# EAGLE design nodeconf2018 (EAGLE 7.7.0)
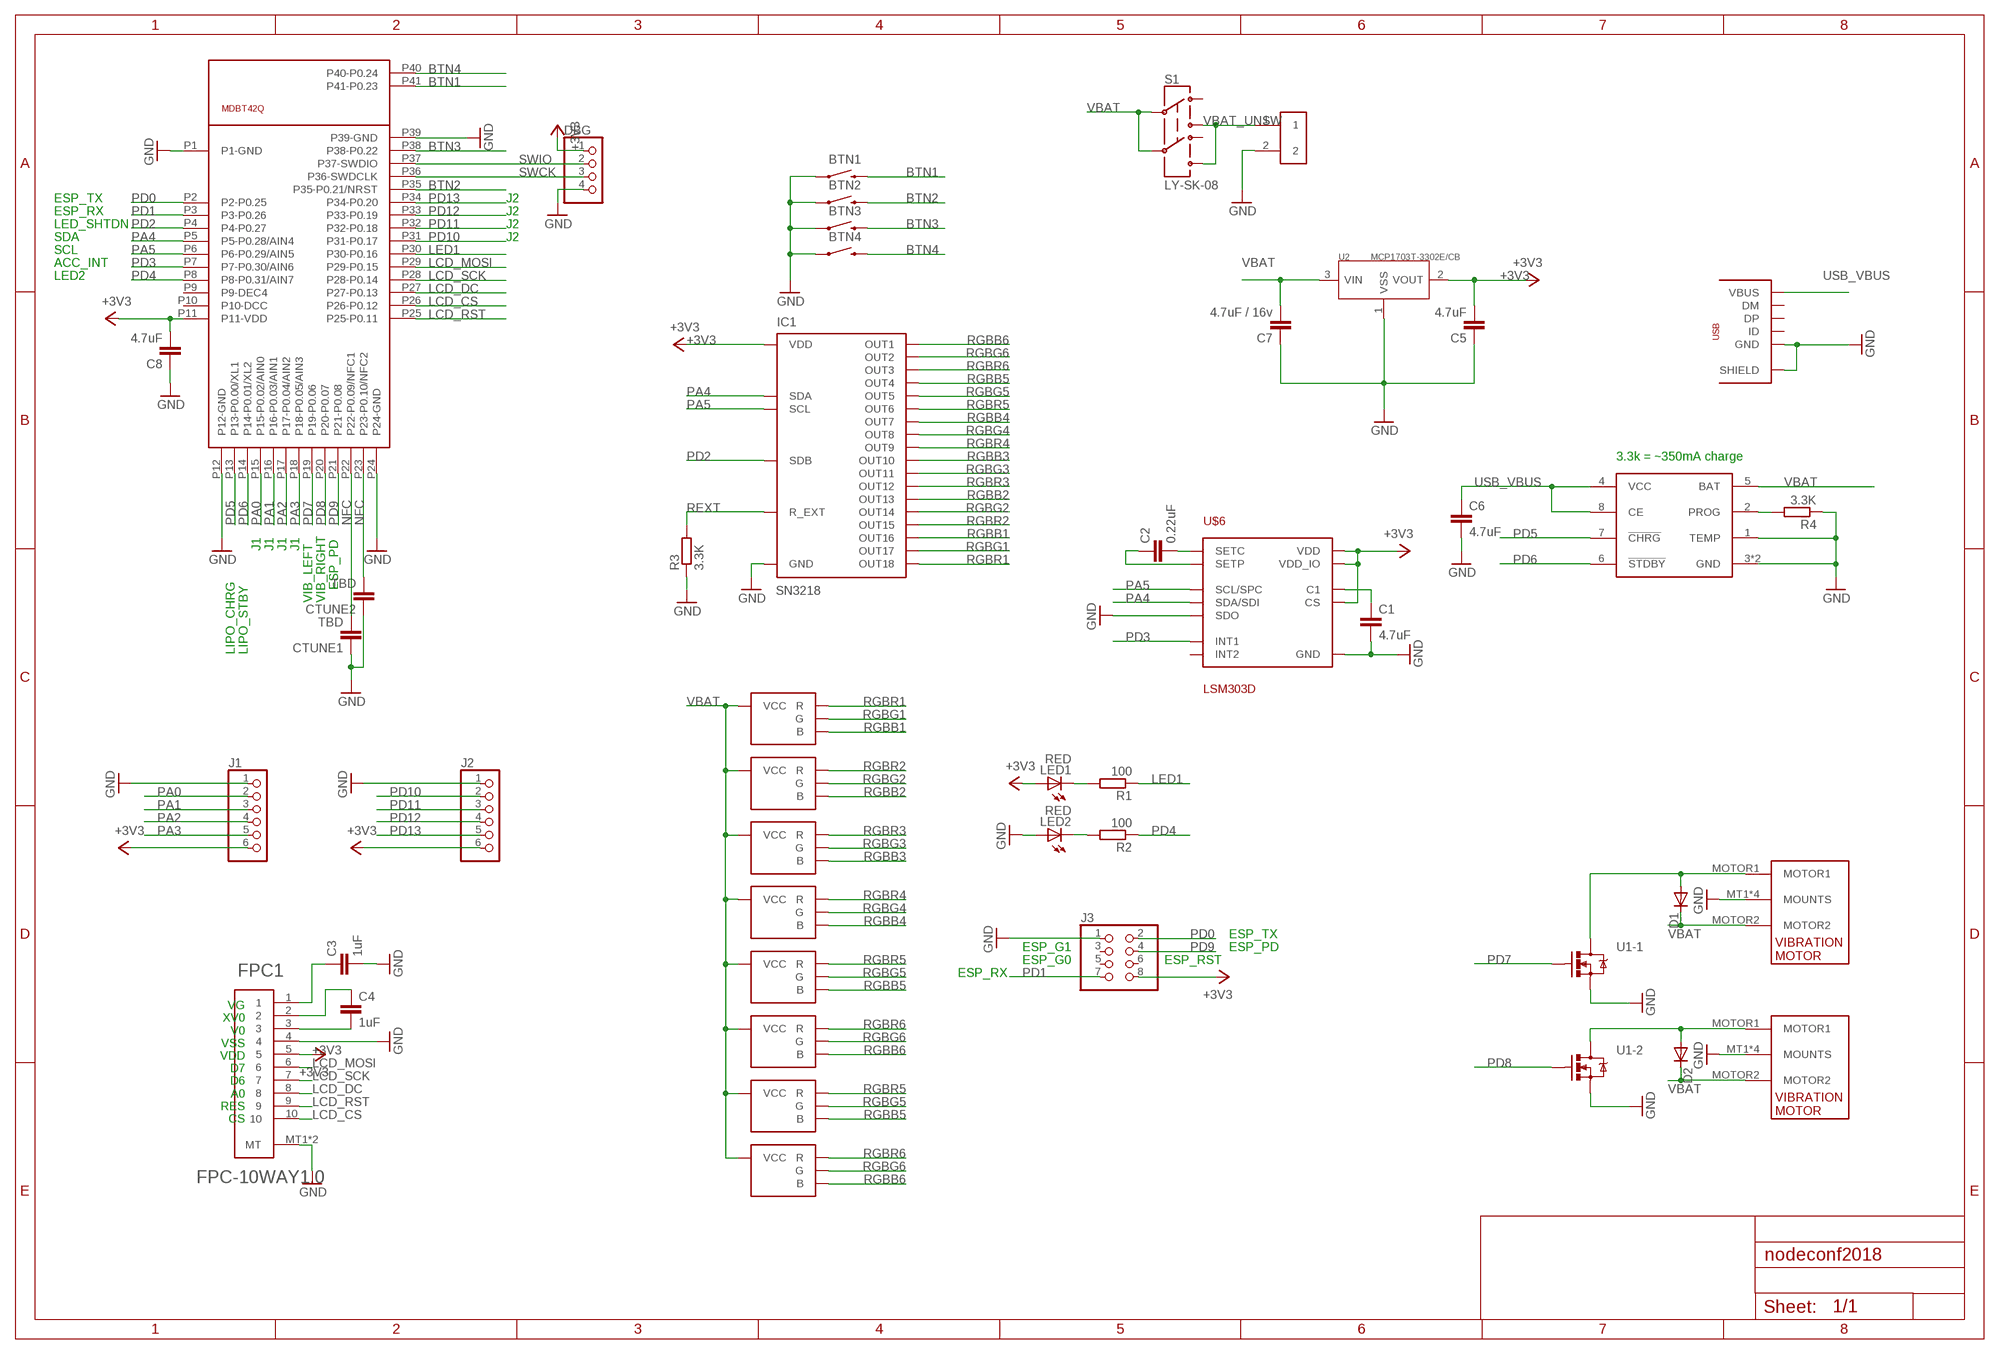
[diagram p0: schematic, sheet 1]

## Parts
BAT  JST_2P_VERTICAL  [2P_JST_PH_VERT]
BLED1  1204RGBC3ADA  [APFA3010SEEZGQBDC]
BLED2  1204RGBC3ADA  [APFA3010SEEZGQBDC]
BLED3  1204RGBC3ADA  [APFA3010SEEZGQBDC]
BLED4  1204RGBC3ADA  [APFA3010SEEZGQBDC]
BLED5  1204RGBC3ADA  [APFA3010SEEZGQBDC]
BLED6  1204RGBC3ADA  [APFA3010SEEZGQBDC]
BLED7  1204RGBC3ADA  [APFA3010SEEZGQBDC]
BLED8  1204RGBC3ADA  [APFA3010SEEZGQBDC]
BTN1  SWITCH-MOMENTARY-2SMD-1101NE  [TACTILE-SWITCH-1101NE]
BTN2  SWITCH-MOMENTARY-2SMD-1101NE  [TACTILE-SWITCH-1101NE]
BTN3  SWITCH-MOMENTARY-2SMD-1101NE  [TACTILE-SWITCH-1101NE]
BTN4  SWITCH-MOMENTARY-2SMD-1101NE  [TACTILE-SWITCH-1101NE]
C1  4.7uF  C-EUC0805  [C0805]
C2  0.22uF  C-EUC0603K  [C0603K]
C3  1uF  C-EUC0603K  [C0603K]
C4  1uF  C-EUC0603K  [C0603K]
C5  4.7uF  C-EUC0805  [C0805]
C6  4.7uF  C-EUC0805  [C0805]
C7  4.7uF / 16v  C-EUC0805  [C0805]
C8  4.7uF  C-EUC0603K  [C0603K]
CTUNE1  TBD  C-EUC0603K  [C0603K]
CTUNE2  TBD  C-EUC0603K  [C0603K]
D1  DIODE-SOD323-W  [SOD323-W]
D2  DIODE-SOD323-W  [SOD323-W]
DBG  PINHD-1X04_2.54-S  [1X04-S]
FPC1  FPC-10WAY1.0  [FPC-1.0MM-10WAY]
IC1  SN3218  [QFN24]
J1  PINHD-1X06_2.54-S  [1X06-S]
J2  PINHD-1X06_2.54-S  [1X06-S]
J3  PINHD-2X04_2.54  [2X04]
LED1  RED  LEDCHIP-LED0603  [CHIP-LED0603]
LED2  RED  LEDCHIP-LED0603  [CHIP-LED0603]
R1  100  R-EU_R0603  [R0603]
R2  100  R-EU_R0603  [R0603]
R3  3.3K  R-EU_R0603  [R0603]
R4  3.3K  R-EU_R0603  [R0603]
S1  LY-SK-08  SWITCH-DPDT  [SWITCH-DPDT]
U1  MOSFET-N-DUAL  [SOT563]
U2  MCP1703T-3302E/CB  XC6206  [SOT23]
U3  TP4056  [SO08-PAD-300]
U$1  VIBRATION_MOTOR  [VIBRATION_MOTOR]
U$2  VIBRATION_MOTOR  [VIBRATION_MOTOR]
U$3  MDBT42Q  [MDBT40]
U$4  USBMICROB  [MICROB-USB]
U$6  LSM303D  [LGA16-3MM]

## Nets
+3V3: C5.2 C8.2 DBG.1 FPC1.5 IC1.3(VDD) J1.6 J2.6 J3.8 LED1.A U2.2(VOUT) U$3.P11(P11-VDD) U$6.1(VDD_IO) U$6.8(CS) U$6.14(VDD)
BTN1: BTN1.2 U$3.P41(P41-P0.23)
BTN2: BTN2.2 U$3.P35(P35-P0.21/NRST)
BTN3: BTN3.2 U$3.P38(P38-P0.22)
BTN4: BTN4.2 U$3.P40(P40-P0.24)
GND [pwr]: BAT.2 BTN1.1 BTN2.1 BTN3.1 BTN4.1 C1.2 C3.2 C5.1 C6.2 C7.1 C8.1 CTUNE1.1 CTUNE2.1 DBG.4 FPC1.4 FPC1.MT1(MT) FPC1.MT2(MT) IC1.4(GND) IC1.GND J1.1 J2.1 J3.1 LED2.A R3.1 R4.1 U1.S1(-1:S) U1.S2(-2:S) U2.1(VSS) U3.1(TEMP) U3.3(GND) U3.PAD(GND) U$1.MT1(MOUNTS) U$1.MT2(MOUNTS) U$1.MT3(MOUNTS) U$1.MT4(MOUNTS) U$2.MT1(MOUNTS) U$2.MT2(MOUNTS) U$2.MT3(MOUNTS) U$2.MT4(MOUNTS) U$3.P1(P1-GND) U$3.P12(P12-GND) U$3.P24(P24-GND) U$3.P39(P39-GND) U$4.GND U$4.SH1(SHIELD) U$4.SH2(SHIELD) U$4.SH3(SHIELD) U$4.SH4(SHIELD) U$4.SH5(SHIELD) U$4.SH6(SHIELD) U$4.SH7(SHIELD) U$4.SH8(SHIELD) U$6.5(GND) U$6.7(SDO) U$6.10(GND) U$6.12(GND) U$6.13(GND) U$6.16(GND)
LCD_CS: FPC1.10 U$3.P26(P26-P0.12)
LCD_DC: FPC1.8 U$3.P27(P27-P0.13)
LCD_MOSI: FPC1.6 U$3.P29(P29-P0.15)
LCD_RST: FPC1.9 U$3.P25(P25-P0.11)
LCD_SCK: FPC1.7 U$3.P28(P28-P0.14)
LED1: R1.1 U$3.P30(P30-P0.16)
N$2: LED1.C R1.2
N$6: C4.2 FPC1.3
N$7: C4.1 FPC1.2
N$8: LED2.C R2.2
N$9: C3.1 FPC1.1
N$11: C1.1 U$6.15(C1)
N$12: C2.2 U$6.2(SETC)
N$13: C2.1 U$6.3(SETP)
N$16: R4.2 U3.2(PROG)
N$18 [pwr]: D2.A U1.D2(-2:D) U$2.MOTOR1
N$19 [pwr]: D1.A U1.D1(-1:D) U$1.MOTOR1
NFC: CTUNE1.2 CTUNE2.2 U$3.P22(P22-P0.09/NFC1) U$3.P23(P23-P0.10/NFC2)
PA0: J1.2 U$3.P15(P15-P0.02/AIN0)
PA1: J1.3 U$3.P16(P16-P0.03/AIN1)
PA2: J1.4 U$3.P17(P17-P0.04/AIN2)
PA3: J1.5 U$3.P18(P18-P0.05/AIN3)
PA4: IC1.5(SDA) U$3.P5(P5-P0.28/AIN4) U$6.6(SDA/SDI)
PA5: IC1.6(SCL) U$3.P6(P6-P0.29/AIN5) U$6.4(SCL/SPC)
PD0: J3.2 U$3.P2(P2-P0.25)
PD1: J3.7 U$3.P3(P3-P0.26)
PD2: IC1.24(SDB) U$3.P4(P4-P0.27)
PD3: U$3.P7(P7-P0.30/AIN6) U$6.11(INT1)
PD4: R2.1 U$3.P8(P8-P0.31/AIN7)
PD5: U3.7(!CHRG) U$3.P13(P13-P0.00/XL1)
PD6: U3.6(!STDBY) U$3.P14(P14-P0.01/XL2)
PD7: U1.G1(-1:G) U$3.P19(P19-P0.06)
PD8: U1.G2(-2:G) U$3.P20(P20-P0.07)
PD9: J3.4 U$3.P21(P21-P0.08)
PD10: J2.2 U$3.P31(P31-P0.17)
PD11: J2.3 U$3.P32(P32-P0.18)
PD12: J2.4 U$3.P33(P33-P0.19)
PD13: J2.5 U$3.P34(P34-P0.20)
REXT: IC1.2(R_EXT) R3.2
RGBB1: BLED1.2(B) IC1.22(OUT16)
RGBB2: BLED2.2(B) IC1.19(OUT13)
RGBB3: BLED3.2(B) IC1.16(OUT10)
RGBB4: BLED4.2(B) IC1.13(OUT7)
RGBB5: BLED5.2(B) BLED7.2(B) IC1.10(OUT4)
RGBB6: BLED6.2(B) BLED8.2(B) IC1.7(OUT1)
RGBG1: BLED1.1(G) IC1.23(OUT17)
RGBG2: BLED2.1(G) IC1.20(OUT14)
RGBG3: BLED3.1(G) IC1.17(OUT11)
RGBG4: BLED4.1(G) IC1.14(OUT8)
RGBG5: BLED5.1(G) BLED7.1(G) IC1.11(OUT5)
RGBG6: BLED6.1(G) BLED8.1(G) IC1.8(OUT2)
RGBR1: BLED1.3(R) IC1.1(OUT18)
RGBR2: BLED2.3(R) IC1.21(OUT15)
RGBR3: BLED3.3(R) IC1.18(OUT12)
RGBR4: BLED4.3(R) IC1.15(OUT9)
RGBR5: BLED5.3(R) BLED7.3(R) IC1.12(OUT6)
RGBR6: BLED6.3(R) BLED8.3(R) IC1.9(OUT3)
SWCK: DBG.3 U$3.P36(P36-SWDCLK)
SWIO: DBG.2 U$3.P37(P37-SWDIO)
USB_VBUS [pwr]: C6.1 U3.4(VCC) U3.8(CE) U$4.VBUS
VBAT [bat]: BLED1.4(VCC) BLED2.4(VCC) BLED3.4(VCC) BLED4.4(VCC) BLED5.4(VCC) BLED6.4(VCC) BLED7.4(VCC) BLED8.4(VCC) C7.2 D1.C D2.C S1.2(A_P) S1.5(B_P) U2.3(VIN) U3.5(BAT) U$1.MOTOR2 U$2.MOTOR2
VBAT_UNSW [bat]: BAT.1 S1.1(A_T2) S1.6(B_T2)
Unconnected: J3.3 J3.5 J3.6 S1.3(A_T1) S1.4(B_T1) U$3.P9(P9-DEC4) U$3.P10(P10-DCC) U$4.DM U$4.DP U$4.ID U$6.9(INT2)

## Notes on the sheet
- ESP_TX | J2
- ESP_RX | J2
- LED_SHTDN | J2
- SDA | J2
- SCL
- ACC_INT
- LED2
- 3.3k = ~350mA charge
- J1 | J1 | J1 | J1
- ESP_PD
- VIB_LEFT | VIB_RIGHT
- LIPO_CHRG | LIPO_STBY
- ESP_TX
- ESP_G1 | ESP_PD
- ESP_G0 | ESP_RST
- ESP_RX
- VG
  XV0
  V0
  VSS
  VDD
  D7
  D6
  A0
  RES
  CS

## Library data of the parts
BAT = pimoroni-connectors:JST_2P_VERTICAL
BLED1-BLED8 = pimoroni:1204RGBC3ADA
BTN1-BTN4 = SparkFun-Electromechanical:SWITCH-MOMENTARY-2: Various NO switches- pushbuttons, reed, etc; PROD_ID: SWCH-00815
C1 C2 C5-C8 CTUNE1 CTUNE2 = rcl:C-EU: CAPACITOR, European symbol
C3 C4 = resistor:C-EU: CAPACITOR, European symbol
D1 D2 = diode:DIODE-: DIODE
DBG = pinhead-2:PINHD-1X04: PIN HEADER
FPC1 = pimoroni-fpc:FPC-10WAY
IC1 = pimoroni:SN3218: SN3218 16-channel LED driver
J1 J2 = pinhead-2:PINHD-1X06: PIN HEADER
J3 = pinhead-2:PINHD-2X04: PIN HEADER
LED1 LED2 = led:LED: LED OSRAM: - CHIPLED LG R971, LG N971, LY N971, LG Q971, LY Q971, LO R971, LY R971 LH N974, LH R974 LS Q976, LO Q976, LY Q976 LO Q996 - Hyper CHIPLED LW Q18S LB Q993, LB Q99A, LB R99A - SideLED LS A670, LO A670, LY A670, LG A670, LP A670 LB A673, LV A673, LT A673, LW A673 LH A674 LY A675 LS A676, LA A676, LO A676, LY A676, LW A676 LS A679, LY A679, LG A679 - Hyper Micro SIDELED® LS Y876, LA Y876, LO Y876, LY Y876 LT Y87S - SmartLED LW L88C, LW L88S LB L89C, LB L89S, LG L890 LS L89K, LO L89K, LY L89K LS L896, LA L896, LO L896, LY L896 - TOPLED LS T670, LO T670, LY T670, LG T670, LP T670 LSG T670, LSP T670, LSY T670, LOP T670, LYG T670 LG T671, LOG T671, LSG T671 LB T673, LV T673, LT T673, LW T673 LH T674 LS T676, LA T676, LO T676, LY T676, LB T676, LH T676, LSB T676, LW T676 LB T67C, LV T67C, LT T67C, LS T67K, LO T67K, LY T67K, LW E67C LS E67B, LA E67B, LO E67B, LY E67B, LB E67C, LV E67C, LT E67C LW T67C LS T679, LY T679, LG T679 LS T770, LO T770, LY T770, LG T770, LP T770 LB T773, LV T773, LT T773, LW T773 LH T774 LS E675, LA E675, LY E675, LS T675 LS T776, LA T776, LO T776, LY T776, LB T776 LHGB T686 LT T68C, LB T68C - Hyper Mini TOPLED® LB M676 - Mini TOPLED Santana® LG M470 LS M47K, LO M47K, LY M47K Source: http://www.osram.convergy.de LUXEON: - LUMILED® LXK2-PW12-R00, LXK2-PW12-S00, LXK2-PW14-U00, LXK2-PW14-V00 LXK2-PM12-R00, LXK2-PM12-S00, LXK2-PM14-U00 LXK2-PE12-Q00, LXK2-PE12-R00, LXK2-PE12-S00, LXK2-PE14-T00, LXK2-PE14-U00 LXK2-PB12-K00, LXK2-PB12-L00, LXK2-PB12-M00, LXK2-PB14-N00, LXK2-PB14-P00, LXK2-PB14-Q00 LXK2-PR12-L00, LXK2-PR12-M00, LXK2-PR14-Q00, LXK2-PR14-R00 LXK2-PD12-Q00, LXK2-PD12-R00, LXK2-PD12-S00 LXK2-PH12-R00, LXK2-PH12-S00 LXK2-PL12-P00, LXK2-PL12-Q00, LXK2-PL12-R00 Source: www.luxeon.com KINGBRIGHT: KA-3528ASYC Source: www.kingbright.com
R1-R4 = resistor:R-EU_: RESISTOR, European symbol
S1 = pimoroni-mechanical:SWITCH-DPDT
U1 = pimoroni-ics:MOSFET-N-DUAL
U2 = xc6206:XC6206
U3 = pimoroni-ics:TP4056
U$1 U$2 = pimoroni-mechanical:VIBRATION_MOTOR
U$3 = mdbt42:MDBT42Q
U$4 = pimoroni-connectors:USB
U$6 = pimoroni-ics:LSM303D

## Net classes
1 pwr: width 0.305 mm
2 bat: width 0.356 mm

## Board
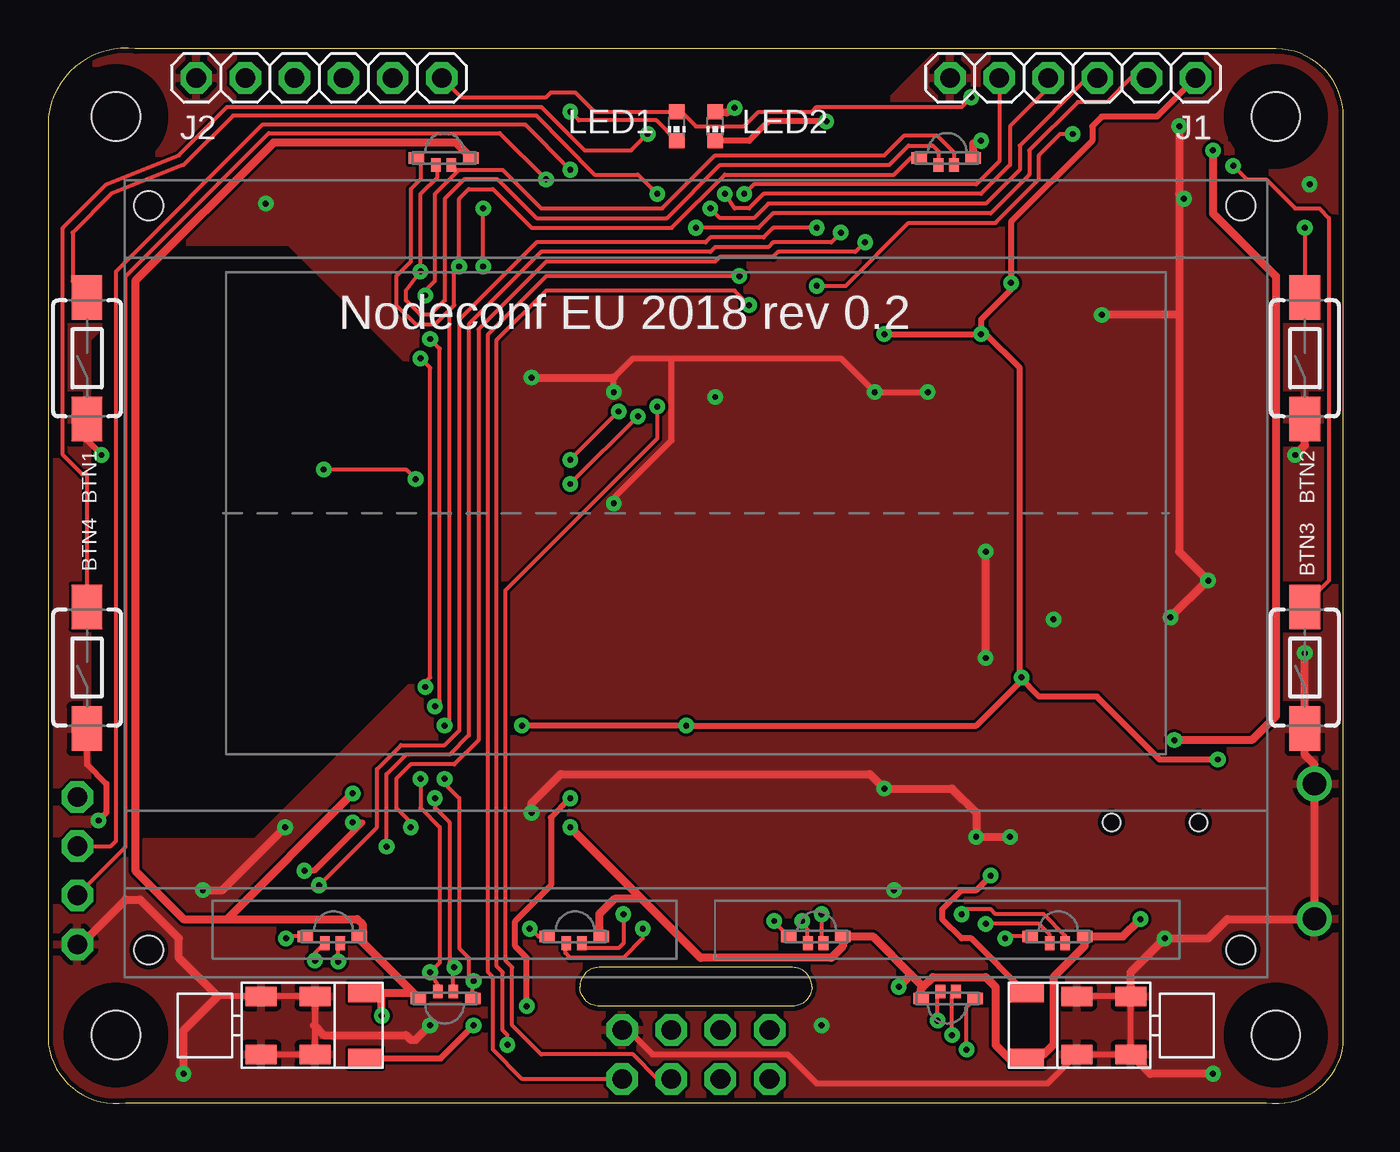
[diagram p1: board, top side]
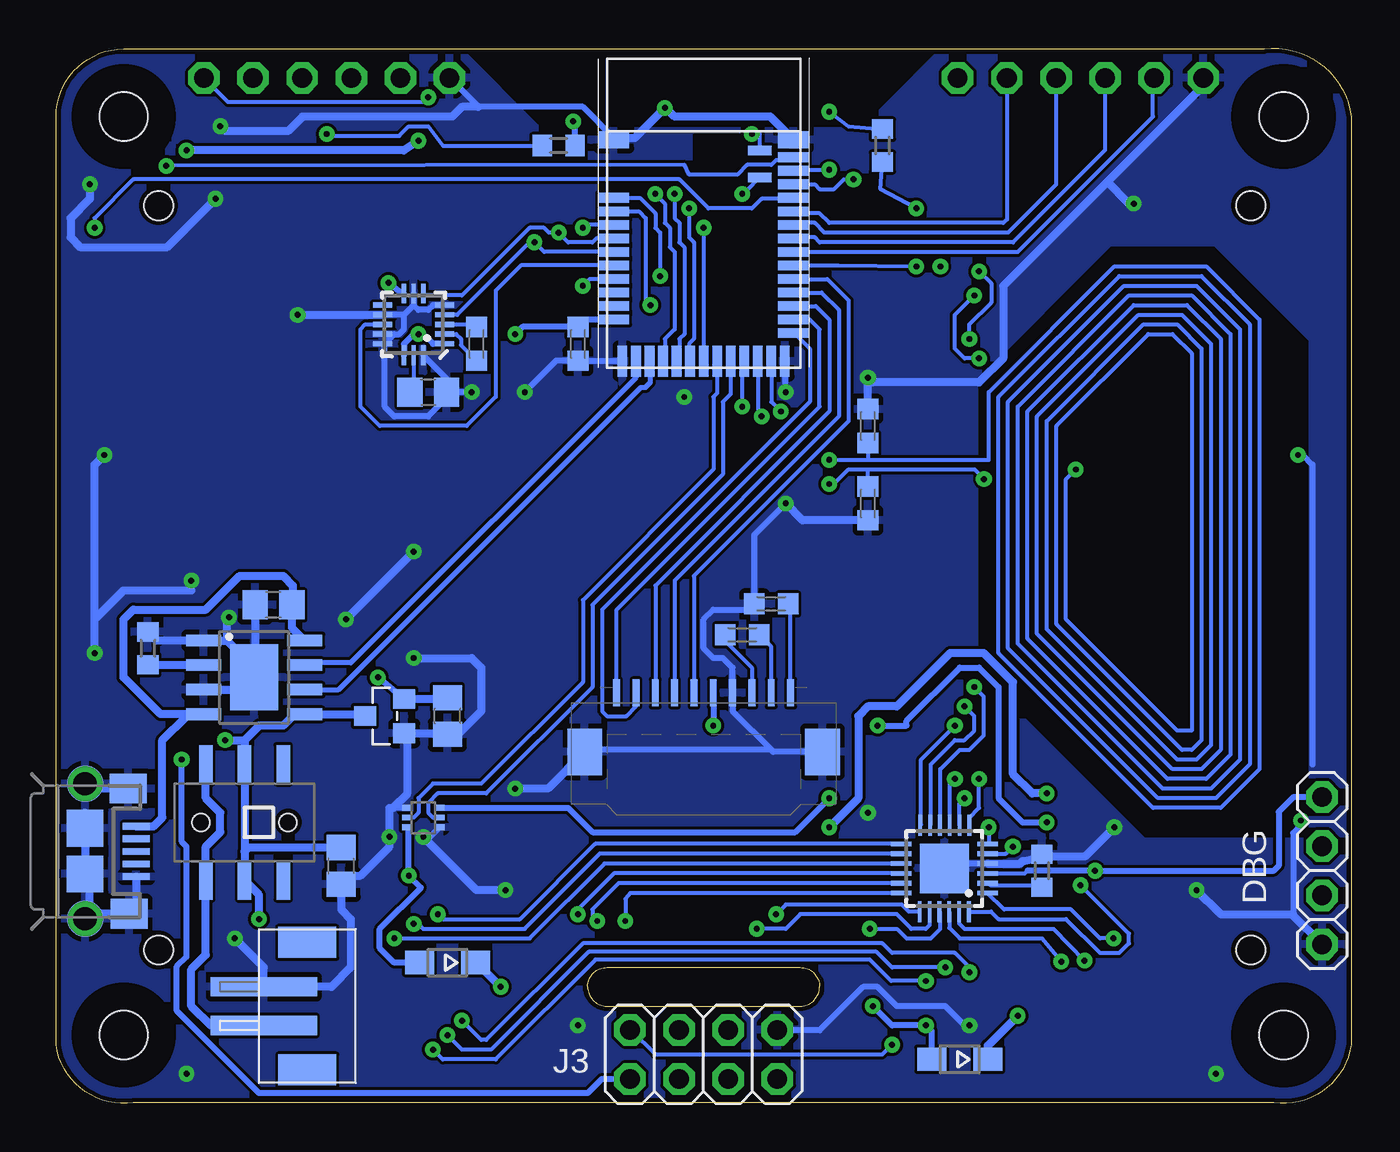
[diagram p2: board, bottom side, seen from below]

Size 67 x 54.56 mm. Coordinates in mm from the lower left corner, seen from the top.
Outline: 67,51.03 arc90 63.5,54.53 4.5,54.53 arc90 0,51.03 0,3.03 arc90 4,0.03 63,0.03 arc90 67,3.03 67,51.03
Outline: 39.5,6.03 arc-90 38.5,5.03 28.5,5.03 arc-90 27.5,6.03 arc-90 28.5,7.03 38.5,7.03 arc-90 39.5,6.03
Copper layers (1*16): Top 0.035mm / dielectric 1.5mm / Bottom 0.035mm
Design rules "pimoroni *": minimum track width 6mil, minimum drill 12mil, track to track 6mil, track to pad 6mil, pad to pad 6mil, via to via 6mil, smd to smd 6mil, copper to edge 0.25mm, drill to drill 6mil, minimum pad ring 12mil, minimum via ring 0.25mm, stop-mask expansion 2mil, vias tented up to drill 25mil, thermal gap 10mil

### Footprints (pad centres in the part's own frame; a part is rotated, then mirrored left to right if it is on the bottom)
2P_JST_PH_VERT = smd 1 x 5.5: 1 -1,4.75; 2 1,4.75 | smd 1.6 x 3: P$1 -3.3,2.5; P$2 3.3,2.5
APFA3010SEEZGQBDC = smd 0.5 x 0.7: 1 0.45,0.75; 2 -0.35,0.75 | smd 0.8 x 0.6: 3 1.45,0.4; 4 -1.35,0.4
TACTILE-SWITCH-1101NE = smd 2.3 x 1.6: 1 -3.15,0; 2 3.15,0
C0805 = smd 1.3 x 1.5: 1 -0.95,0; 2 0.95,0
C0603K = smd 1.05 x 1.08: 1 -0.875,0; 2 0.875,0
SOD323-W = smd 1.5 x 1.2: A 1.45,0; C -1.45,0
1X04-S = drill 1.016 octagon: 1 -3.81,0; 2 -1.27,0; 3 1.27,0; 4 3.81,0
FPC-1.0MM-10WAY = smd 0.35 x 1.4: 1 4.5,0.7; 2 3.5,0.7; 3 2.5,0.7; 4 1.5,0.7; 5 0.5,0.7; 6 -0.5,0.7; 7 -1.5,0.7; 8 -2.5,0.7; 9 -3.5,0.7; 10 -4.5,0.7 | smd 1.8 x 2.4: MT1 -6.15,-2.35; MT2 6.15,-2.35
QFN24 = smd 1.108 x 0.254: 1 -2.235,1.27; 2 -2.235,0.762; 3 -2.235,0.254; 4 -2.235,-0.254; 5 -2.235,-0.762; 6 -2.235,-1.27; 13 2.235,-1.27; 14 2.235,-0.762; 15 2.235,-0.254; 16 2.235,0.254; 17 2.235,0.762; 18 2.235,1.27 | smd 0.254 x 1.108: 7 -1.295,-2.235; 8 -0.787,-2.235; 9 -0.279,-2.235; 10 0.229,-2.235; 11 0.737,-2.235; 12 1.245,-2.235; 19 1.27,2.235; 20 0.762,2.235; 21 0.254,2.235; 22 -0.254,2.235; 23 -0.762,2.235; 24 -1.27,2.235 | smd 2.54 x 2.54: GND 0,0
1X06-S = drill 1.016 octagon: 1 -6.35,0; 2 -3.81,0; 3 -1.27,0; 4 1.27,0; 5 3.81,0; 6 6.35,0
2X04 = drill 1.016 octagon: 1 -3.81,-1.27; 2 -3.81,1.27; 3 -1.27,-1.27; 4 -1.27,1.27; 5 1.27,-1.27; 6 1.27,1.27; 7 3.81,-1.27; 8 3.81,1.27
CHIP-LED0603 = smd 0.8 x 0.8: A 0,-0.75; C 0,0.75
R0603 = smd 1 x 1.1: 1 -0.85,0; 2 0.85,0
SWITCH-DPDT = smd 2 x 0.7: 1 3,2; 2 3,0; 3 3,-2; 4 -3,-2; 5 -3,0; 6 -3,2 | hole 0.9: 0,-2.25; 0,2.25
SOT563 = smd 0.3 x 0.5: D1 0.5,-0.85; D2 -0.5,0.85; G1 0,0.85; G2 0,-0.85; S1 0.5,0.85; S2 -0.5,-0.85
SOT23 = smd 1.016 x 1.143: 1 -0.889,-1.016; 2 0.889,-1.016; 3 0,1.016
SO08-PAD-300 = smd 0.6 x 1.8: 1 -1.905,-2.616; 2 -0.635,-2.616; 3 0.635,-2.616; 4 1.905,-2.616; 5 1.905,2.616; 6 0.635,2.616; 7 -0.635,2.616; 8 -1.905,2.616 | smd 3.4 x 2.5: PAD 0,0
VIBRATION_MOTOR = smd 1.78 x 1: MOTOR1 6.9,-1.7; MOTOR2 6.9,1.7 | smd 1.6 x 1: MT1 1.5,1.5; MT2 1.5,-1.5; MT3 4.3,-1.5; MT4 4.3,1.5
MDBT40 = smd 1.6 x 0.9: P1 -4.65,3.8; P39 4.65,3.8 | smd 1.6 x 0.5: P2 -4.65,0.8; P3 -4.65,0.1; P4 -4.65,-0.6; P5 -4.65,-1.3; P6 -4.65,-2; P7 -4.65,-2.7; P8 -4.65,-3.4; P9 -4.65,-4.1; P10 -4.65,-4.8; P11 -4.65,-5.5; P25 4.65,-6.2; P26 4.65,-5.5; P27 4.65,-4.8; P28 4.65,-4.1; P29 4.65,-3.4; P30 4.65,-2.7; P31 4.65,-2; P32 4.65,-1.3; P33 4.65,-0.6; P34 4.65,0.1; P35 4.65,0.8; P36 4.65,1.5; P37 4.65,2.2; P38 4.65,2.9 | smd 0.5 x 1.6: P12 -4.2,-7.65; P13 -3.5,-7.65; P14 -2.8,-7.65; P15 -2.1,-7.65; P16 -1.4,-7.65; P17 -0.7,-7.65; P18 0,-7.65; P19 0.7,-7.65; P20 1.4,-7.65; P21 2.1,-7.65; P22 2.8,-7.65; P23 3.5,-7.65; P24 4.2,-7.65 | smd 1.2 x 0.5: P40 2.9,3.25; P41 2.9,1.85
MICROB-USB = smd 0.35 x 1.4: DM -0.65,2.65; DP 0,2.65; GND 1.3,2.65; ID 0.65,2.65; VBUS -1.3,2.65 | smd 1.546 x 1.9: SH1 -3.251,2.235; SH2 3.226,2.286 | drill 1.2 pad 1.6: SH3 3.48,0; SH8 -3.505,0 | smd 1.9 x 1.9: SH4 3.48,0; SH5 1.168,0; SH6 -1.194,0; SH7 -3.505,0
LGA16-3MM = smd 1 x 0.25: 1 -1.6,1; 2 -1.6,0.5; 3 -1.6,0; 4 -1.6,-0.5; 5 -1.6,-1; 9 1.6,-1; 10 1.6,-0.5; 11 1.6,0; 12 1.6,0.5; 13 1.6,1 | smd 0.25 x 1: 6 -0.5,-1.6; 7 0,-1.6; 8 0.5,-1.6; 14 0.5,1.6; 15 0,1.6; 16 -0.5,1.6
128X64_LCD_FRAME = hole 1.5: -28.3,39.9; -28.3,1.4; 28.2,39.9; 28.2,1.4
M2.5-HOLE-WITH-MASK = hole 2.5: 0,0

### Placement (x,y rotation side)
BAT  51.5,5.03 90 bottom
BLED1  14.75,9.03 180 top
BLED2  27.25,9.03 180 top
BLED3  39.75,9.03 180 top
BLED4  52.25,9.03 180 top
BLED5  20.5,49.28 180 top
BLED6  20.5,5.03 0 top
BLED7  46.5,49.28 180 top
BLED8  46.5,5.03 0 top
BTN1  2,38.53 90 top
BTN2  65,38.53 90 top
BTN3  65,22.53 90 top
BTN4  2,22.53 90 top
C1  47.75,36.78 0 bottom
C2  45.25,39.28 270 bottom
C3  30,25.83 180 bottom
C4  31.5,24.23 180 bottom
C5  46.75,20.03 90 bottom
C6  55.75,25.78 180 bottom
C7  52.25,12.28 90 bottom
C8  40,39.28 90 bottom
CTUNE1  25,31.03 90 bottom
CTUNE2  25,35.03 270 bottom
D1  20.25,2.28 180 bottom
D2  46.75,7.28 180 bottom
DBG  1.5,12.03 270 bottom
FPC1  33.5,20.53 0 bottom
IC1  21.05,12.15 180 bottom
J1  53,53.03 0 top
J2  14,53.03 0 top
J3  33.5,2.53 180 bottom
LED1  32.5,50.53 180 top
LED2  34.5,50.53 180 top
R1  24.25,49.53 90 bottom
R2  41,49.53 0 bottom
R3  16,12.03 270 bottom
R4  62.25,23.53 270 bottom
S1  57.25,14.53 90 bottom
U1  48,14.78 90 bottom
U2  50,20.03 90 bottom
U3  56.75,22.03 270 bottom
U$1  9.5,4.03 0 top
U$2  57.5,4.03 180 top
U$3  33.5,46.03 0 bottom
U$4  65.5,13.03 270 bottom
U$6  48.5,40.28 180 bottom
U$11  [128X64_LCD_FRAME]  33.5,6.53 0 top
U$12  [M2.5-HOLE-WITH-MASK]  3.5,3.53 0 top
U$13  [M2.5-HOLE-WITH-MASK]  63.5,3.53 0 top
U$14  [M2.5-HOLE-WITH-MASK]  63.5,51.03 0 top
U$15  [M2.5-HOLE-WITH-MASK]  3.5,51.03 0 top

### Tracks (layer width: path | path; a pad name or v marks a point on that pad's centre or on a via)
+3V3  (via drill 0.3)  (1 unrouted)
  Top 0.203: J2.6 21.35,52.03 25.75,52.03 26,52.28 27.25,52.28 28.25,51.28 LED1.A 32.75,51.28 33.5,50.53 36,50.53 36.75,51.28 39.5,51.28 39.75,51.53 47.25,51.53 v47.75,52.03
  Top 0.305: v48.25,39.78 48.25,40.53 49.8,42.08 v49.8,42.43 49.8,45.58 54,49.78 54,50.53 54.5,51.03 57.35,51.03 J1.6 | v43.25,39.78 v48.25,39.78 | v60.5,17.78 57.5,17.78 54.25,21.03 51.25,21.03 50.25,22.03 50.25,21.78 48,19.53 v33,19.53 v24.5,19.53 | v13.25,12.03 13.75,12.03 16.25,14.53 v15.75,14.53 | v50.34,22.03 50.25,22.19 50.25,38.03 48.5,39.78 v48.25,39.78
  Bottom 0.203: IC1.3 16.89,11.9 16.75,12.03 | v47.75,52.03 48,51.78 58.1,51.78 J1.6
  Bottom 0.305: J3.8 38.77,1.26 39.5,0.53 56.5,0.53 60.75,4.78 60.75,7.08 60.25,7.58 60.25,13.28 60.5,13.53 v60.5,17.78 | U$6.1 47.5,39.28 48,39.78 v48.25,39.78 48.5,39.78 49,39.28 U$6.14 | U$6.8 49.1,41.88 v49.8,42.43 | U$3.P11 39.62,40.53 C8.2 42.88,40.16 v43.25,39.78 | 50.25,22.03 v50.34,22.03 U2.2 | FPC1.5 v33,19.53 | v24.5,19.53 23,19.53 23,19.78 20.25,22.53 19.25,22.53 18.25,21.53 18.25,15.78 17,14.53 v15.75,14.53 | 16.75,12.03 v13.25,12.03 4,12.03 3.75,12.28 3.75,15.08 2.99,15.84 DBG.1
  Bottom 0.406: U2.2 46.81,20.92 C5.2
BTN1  (via drill 0.3)
  Top 0.203: v31.5,47.03 30.5,48.03 28.25,48.03 25.25,51.08 9.55,51.08 7,48.53 3.25,47.03 1.25,45.03 1.25,42.53 2,41.78 BTN1.2
  Bottom 0.203: v31.5,47.03 31.2,47.28 U$3.P41
BTN2  (via drill 0.3)
  Top 0.203: v65,45.28 BTN2.2
  Bottom 0.203: U$3.P35 28.9,46.78 30.5,46.78 31,46.28 33.25,46.28 34.75,47.78 63,47.78 65,45.78 v65,45.28
BTN3  (via drill 0.3)
  Top 0.203: v61.3,48.48 62,47.78 63,47.78 64.5,46.28 65.75,46.28 66.25,45.78 66.25,27.03 65,25.78 BTN3.2
  Bottom 0.203: U$3.P38 29,48.78 29.75,48.78 30,48.53 31.25,48.53 31.75,48.03 34.25,48.03 34.5,48.53 v61.3,48.48
BTN4  (via drill 0.3)
  Top 0.203: BTN4.2 2,32.53 1.75,32.53 0.75,33.53 0.75,45.28 3,47.53 6.75,49.03 9.25,51.53 25.5,51.53 27.75,49.28 30.15,49.28 v31,50.13
  Bottom 0.203: v31,50.13 30.6,50.13 U$3.P40
GND  (via drill 0.3)
  Top 0.305: BTN4.1 2,17.53 3,16.53 3,15.03 v2.6,14.63 | BTN1.1 2,34.28 v2.75,33.53 | J3.1 29.98,3.8 31.25,2.53 38.25,2.53 39.75,1.03 51.7,1.03 U$2.MT4 U$2.MT1 U$2.MT2 U$2.MT3 | U$1.MT2 U$1.MT3 U$1.MT4 | U$1.MT4 U$1.MT1 8.75,5.53 | U$1.MT4 13.8,4.08 13.75,4.03 | v45.5,36.78 v42.75,36.78 41,38.53 32.25,38.53 | v29.25,36.78 29.25,37.53 30.25,38.53 32.25,38.53 | v29.25,31.03 29.25,31.28 32.25,34.28 32.25,38.53
  Top 0.406: v35.5,51.48 35.1,51.23 LED2.A | BTN3.1 65,18.03 65.5,17.53 U$4.SH7 U$4.SH3 65.48,9.53 61,9.53 60,8.53 v57.75,8.53 56,6.78 U$2.MT2 | BTN3.1 65,19.78 65.25,20.03 | 65.25,20.03 65.25,19.63 BTN3.1 | v49.75,13.78 v48,13.78 48,15.03 46.75,16.28 v43.25,16.28 42.5,17.03 26.5,17.03 25,15.53 v25,15.03 | 65.25,20.03 65,20.28 v65,23.28 | v58.05,25.13 59.95,27.03 v60,27.03 58.5,28.53 58.5,40.78 | v64.5,33.53 65,34.03 BTN2.1 | v58.5,50.53 58.5,47.03 | 58.5,47.03 58.5,40.78 | 58.5,40.78 v54.5,40.78 | v25,37.53 29.25,37.53 | DBG.4 1.69,8.22 4,10.53 4.75,10.53 6.75,8.53 6.75,7.53 8.75,5.53 7,3.78 v7,1.53 | v8,11.03 9,11.03 v12.25,14.28 | v60.25,1.53 57,1.53 U$2.MT1 | v48.5,23.03 v48.5,28.53 | v58.75,46.78 58.5,47.03 | 13.75,4.03 14.25,3.53 18.5,3.53 18.75,3.28 19,3.28 v19.75,4.03
  Bottom 0.305: U$6.5 47.5,41.28 47.75,41.03 48.25,41.03 48.5,41.28 | U$6.7 48.5,41.28 | 48.5,41.28 49,40.78 | 49,40.78 U$6.10 | U$6.12 49.5,39.78 | 49.5,39.78 49.25,39.78 49,40.03 49,40.78 | 49.5,39.78 50,39.28 U$6.13 50,39.18 50,36.03 49.5,35.53 47.75,35.53 46.8,36.48 C1.2 | C1.2 46.8,37.48 U$6.16 | U$3.P12 37.73,38.41 C8.1 41.12,38.41 v42.75,36.78 | U$3.P1 38.15,49.93 39.75,51.53 45.15,51.53 J1.1 | DBG.4 1.5,8.28 | v2.75,33.53 2.5,33.53 2,33.03 2,17.53 | IC1.4 20.79,12.4 IC1.GND | 30,18.28 32,20.28 FPC1.4 32,22.53 32.5,23.03 33,23.03 33.5,23.53 33.5,25.03 33,25.53 31.18,25.53 C3.2 30.88,29.41 v29.25,31.03 | 30,18.28 39.55,18.28 FPC1.MT1 | FPC1.MT2 29.9,18.18 30,18.28 | v19.75,4.03 20,4.03 21,5.03 23.5,5.03 24.5,6.03 25.25,6.03 27.5,3.78 29.67,3.78 J3.1 | v45.5,36.78 C1.2 | U$3.P24 29.3,36.83 v29.25,36.78 | U1.S2 47.65,13.78 v48,13.78 | U1.S1 49.55,15.28 49.75,15.28 | v2.6,14.63 2.6,14.38 3,13.98 3,9.78
  Bottom 0.406: U$3.P39 30.05,51.03 35,51.03 v35.5,51.48 37.05,49.93 38.15,49.93 | IC1.4 17.13,12.4 17,12.53 15.85,12.78 | 15.85,12.78 R3.1 | R4.1 61.8,23.94 U3.1 58.16,23.94 | 58.16,23.94 57,22.78 57,22.28 U3.PAD | U3.3 57.38,21.4 U3.PAD | C6.2 56.7,22.08 U3.PAD | 65.25,9.81 U$4.SH2 62.85,10.17 U$4.GND | 65.25,9.81 U$4.SH3 | U$4.SH1 65.25,16.28 U$4.SH7 | 65.25,9.81 65.25,11.61 U$4.SH5 U$4.SH6 65.5,15.03 | v57.75,8.53 56.25,7.03 BAT.2 52.75,6.03 51.75,7.03 51.75,9.53 52.25,10.03 C7.1 51.8,11.78 51.25,11.78 49.75,13.28 v49.75,13.78 49.75,15.28 | FPC1.MT1 41.55,16.28 v43.25,16.28 | 49.55,15.28 48.85,15.98 48.85,19.01 U2.1 46.81,19.14 C5.1 46.7,19.03 46.25,19.03 45,20.28 45,22.53 45.5,23.03 v48.5,23.03 | v65,23.28 65,25.03 | v60,27.03 60,26.53 63.5,26.53 65,25.03 | 65,25.03 65,33.03 v64.5,33.53 | 45.15,51.53 46,51.53 46.5,51.03 54.25,51.03 55,50.28 58.25,50.28 v58.5,50.53 | v54.5,40.78 U$6.10 | CTUNE2.1 v25,37.53 24.75,37.28 19.25,37.28 18,38.53 18,42.28 12.62,47.66 | J2.1 7.65,52.63 12.62,47.66 | CTUNE1.1 28.38,30.16 v29.25,31.03 | 15.85,12.78 13.75,12.78 v12.25,14.28 | 3,9.78 3.06,9.78 | v8,11.03 6.75,9.78 3.06,9.78 | 3.06,9.78 DBG.4 | v43.75,11.03 45.25,11.03 v48,13.78 | v48.5,28.53 v52,25.03 | 58.16,23.94 58.16,25.03 v58.05,25.13 | v65.25,47.53 65.25,46.78 66.25,45.78 66.25,44.78 65.75,44.28 61.25,44.28 v58.75,46.78 | v11.25,46.53 11.5,46.53 12.62,47.66
  other vias: 34.5,36.53 40,4.03
  pour Top: 0,54.53 21,54.53 25.25,50.28 42,50.28 46.25,54.53 67,54.53 67,0.03 0,0.03 0,13.53 10.75,13.53 19.5,22.28 19.5,37.53 12.5,44.53 7,44.53 2,39.53 2,13.78 0,13.78
  pour Bottom: 0,54.53 21,54.53 25.25,50.28 42,50.28 46.25,54.53 67,54.53 67,0.28 67.25,0.03 0,0.03 0,13.53 10.75,13.53 19.5,22.28 19.5,37.53 12.5,44.53 7,44.53 2,39.53 2,13.78 0,13.78
LCD_CS
  Bottom 0.203: FPC1.10 38,25.53 27.5,36.03 27.5,40.03 28,40.53 U$3.P26
LCD_DC
  Bottom 0.203: U$3.P27 27.7,41.23 27,40.53 27,35.78 36,26.78 FPC1.8
LCD_MOSI
  Bottom 0.203: U$3.P29 27.1,42.63 26,41.53 26,35.28 34,27.28 FPC1.6
LCD_RST
  Bottom 0.203: U$3.P25 28.8,39.83 28,39.03 28,36.28 38.75,25.53 38.75,20.28 38.5,20.03 37.5,20.03 37,20.53 FPC1.9
LCD_SCK
  Bottom 0.203: U$3.P28 27.4,41.93 26.5,41.03 26.5,35.53 35,27.03 FPC1.7
LED1  (via drill 0.3)
  Top 0.203: v22.5,43.28 v22.5,46.28
  Bottom 0.203: U$3.P30 26.55,43.33 v22.5,43.28 | v22.5,46.28 24.35,47.28 R1.1
N$2  (via drill 0.3)
  Top 0.203: LED1.C 31.45,50.83 27.45,50.83 v27,51.28
  Bottom 0.203: v27,51.28 26,50.53 R1.2
N$6
  Bottom 0.203: C4.2 32.38,23.91 31,22.53 FPC1.3
N$7
  Bottom 0.203: FPC1.2 30,23.61 C4.1
N$8  (via drill 0.3)
  Top 0.305: v40.25,50.78 37.25,50.78 36.25,49.78 LED2.C
  Bottom 0.305: R2.2 40.15,50.68 v40.25,50.78
N$9
  Bottom 0.203: FPC1.1 29,25.71 C3.1
N$11
  Bottom 0.203: U$6.15 48.5,36.98 C1.1
N$12
  Bottom 0.203: U$6.2 46.3,39.78 46.05,39.53 46.05,39.21 C2.2
N$13
  Bottom 0.203: U$6.3 45.38,40.28 C2.1
N$16
  Bottom 0.406: R4.2 59.38,22.68 U3.2
N$18  (via drill 0.3)
  Top 0.305: U$2.MOTOR1 50.55,5.73 47.75,8.53 47.25,8.53 46.25,9.53 46.25,10.03 47.25,11.03 48,11.03 v48.75,11.78
  Bottom 0.305: U1.D2 48.75,14.18 v48.75,11.78 48.12,11.16 50.25,9.03 50.25,8.03 49.5,7.28 D2.A
N$19  (via drill 0.3)
  Top 0.305: U$1.MOTOR1 20.3,2.33 v22,4.03 | v24.75,5.03 24.75,7.53 24.15,8.13 24.15,9.43 26,11.28 26,14.78 v27,15.78
  Bottom 0.305: v24.75,5.03 23.75,4.03 v22,4.03 21.7,3.73 D1.A | U1.D1 40.5,15.28 39.25,14.03 28.75,14.03 v27,15.78
NFC  (via drill 0.3)
  Top 0.203: v29.5,35.78 v27,33.28 | v30.5,35.53 v27,32.03 | v14.25,32.78 18.5,32.78 v19,32.28
  Bottom 0.203: U$3.P23 30,36.28 v29.5,35.78 | U$3.P22 30.7,35.73 v30.5,35.53 | v27,33.28 25,33.28 | 25,33.28 18.75,33.28 18.75,36.78 12.25,43.28 7.5,43.28 4.75,40.53 4.75,17.28 6.75,15.28 10.25,15.28 18.25,23.28 18.25,36.53 12,42.78 7.75,42.78 5.25,40.28 5.25,17.53 7,15.78 10,15.78 17.75,23.53 17.75,36.28 11.75,42.28 8,42.28 5.75,40.03 5.75,17.78 7.25,16.28 9.75,16.28 17.25,23.78 17.25,36.03 11.5,41.78 8.25,41.78 6.25,39.78 6.25,18.03 7.5,16.78 9.5,16.78 16.75,24.03 16.75,35.78 11.25,41.28 8.5,41.28 6.75,39.53 6.75,18.28 7.75,17.28 9.25,17.28 16.25,24.28 16.25,35.53 11,40.78 8.75,40.78 7.25,39.28 7.25,18.53 8,17.78 9,17.78 15.75,24.53 15.75,35.28 10.75,40.28 9,40.28 7.75,39.03 7.75,18.78 8.25,18.28 8.75,18.28 15.25,24.78 15.25,35.03 10.5,39.78 9.25,39.78 8.25,38.78 8.25,19.28 9,19.28 14.75,25.03 14.75,32.28 v14.25,32.78 | v27,32.03 26.75,32.03 26,32.78 25,32.78 | 25,32.78 19.5,32.78 v19,32.28 | CTUNE1.2 25,32.78 | CTUNE2.2 25,33.28
PA0  (via drill 0.3)
  Top 0.203: J1.2 49.19,48.72 48,47.53 36.5,47.53 v36,47.03
  Bottom 0.203: v36,47.03 35.75,47.03 35.75,46.78 35.5,46.53 35.5,45.53 35.25,45.28 35.25,44.28 35,44.03 35,40.03 35.5,39.53 35.5,38.48 U$3.P15 35.75,38.53
PA1  (via drill 0.3)
  Top 0.203: J1.3 51.73,52.51 49.75,50.53 49.75,48.53 48.25,47.03 37,47.03 36.25,46.28 35.5,46.28 v35,47.03
  Bottom 0.203: 35,38.48 U$3.P16 34.75,38.53 34.75,39.53 34.5,39.78 34.5,44.28 34.75,44.53 34.75,45.53 35,45.78 v35,47.03
PA2  (via drill 0.3)
  Top 0.203: J1.4 53.75,53.03 50.25,49.53 50.25,48.28 48.5,46.53 37.25,46.53 36.5,45.78 34.75,45.78 v34.25,46.28
  Bottom 0.203: v34.25,46.28 34.25,44.78 34,44.53 34,39.53 34.25,39.28 34.25,38.43 U$3.P17
PA3  (via drill 0.3)
  Top 0.203: J1.5 56,53.03 54.75,51.78 53.25,51.78 50.75,49.28 50.75,48.03 48.75,46.03 37.5,46.03 36.75,45.28 v33.5,45.28
  Bottom 0.203: v33.5,45.28 U$3.P18
PA4  (via drill 0.3)
  Top 0.203: v41,45.03 40.5,44.53 37.5,44.53 37.25,44.28 34.5,44.28 34.25,44.03 25.5,44.03 21.75,40.28 21.75,19.03 20.75,18.03 18.5,18.03 17.5,17.03 v17.5,13.28
  Bottom 0.203: U$3.P5 39.05,44.73 39.25,44.53 40.5,44.53 v41,45.03 41.5,45.03 41.75,45.28 42.5,45.28 46,41.78 47.9,41.78 U$6.6 | IC1.5 17.87,12.91 v17.5,13.28
PA5  (via drill 0.3)
  Top 0.203: v42.25,44.53 41.75,44.03 37.75,44.03 37.5,43.78 34.75,43.78 34.5,43.53 25.75,43.53 22.25,40.03 22.25,18.78 21,17.53 18.75,17.53 18,16.78 18,15.28 18.75,14.53 v18.75,14.28
  Bottom 0.203: U$3.P6 41.75,44.03 v42.25,44.53 42.5,44.53 46.25,40.78 U$6.4 | v18.75,14.28 18.75,13.48 IC1.6
PD0  (via drill 0.3)
  Top 0.203: v35.75,42.78 25.75,42.78 22.75,39.78 22.75,6.78 23,6.53 23,2.78 24.52,1.26 J3.2
  Bottom 0.203: U$3.P2 36.8,46.83 36,46.03 36,45.28 35.75,45.03 v35.75,42.78
PD1  (via drill 0.3)
  Top 0.203: v36.25,41.28 35.5,42.03 25.75,42.03 23.2,39.48 23.2,7.08 23.5,6.78 23.5,3.78 23.75,3.53 v23.75,3.03
  Bottom 0.203: U$3.P3 36.85,46.13 36.5,45.78 36.5,41.53 v36.25,41.28 | J3.7 37.27,3.8 36,2.53 24.25,2.53 v23.75,3.03
PD2  (via drill 0.3)
  Top 0.203: v39.75,45.28 37.5,45.28 37,44.78 34.25,44.78 34,44.53 25.25,44.53 21.25,40.53 21.25,19.28 20.5,18.53 18.25,18.53 17,17.28 17,14.28 v14,11.28
  Bottom 0.203: U$3.P4 39.6,45.43 v39.75,45.28 | IC1.24 18.63,9.91 18.25,9.53 14.75,9.53 13,7.78 12,7.78 11.5,8.28 11.5,8.78 v14,11.28
PD3
  Bottom 0.203: U$3.P7 42.95,43.33 44.25,42.03 44.25,36.53 45.75,35.03 50.25,35.03 51.25,36.03 51.25,40.03 51,40.28 U$6.11
PD4  (via drill 0.3)
  Top 0.203: v39.75,42.28 41.25,42.28 44.5,45.53 49,45.53 51.25,47.78 51.25,49.03 52.35,50.13 v53,50.13
  Bottom 0.203: U$3.P8 39.4,42.63 v39.75,42.28 | v53,50.13 52.9,50.03 49.25,50.03 48.75,50.53 47.75,50.53 47,49.53 R2.1
PD5
  Bottom 0.254: U$3.P13 37,37.53 51.75,22.78 54.02,22.78 U3.7
PD6
  Bottom 0.254: U3.6 52.38,21.4 36.75,37.03 36.5,37.03 36.25,37.28 36.25,38.33 U$3.P14
PD7
  Bottom 0.203: U$3.P19 32.8,36.73 33,36.53 33,32.78 39.75,26.03 39.75,21.78 45,16.53 47.5,16.53 48.25,15.78 48.25,15.03 48.5,14.78 U1.G1
PD8
  Bottom 0.203: U$3.P20 32.1,36.68 32.5,36.28 32.5,32.53 39.25,25.78 39.25,21.53 44.75,16.03 47.25,16.03 47.75,15.53 47.75,15.03 47.5,14.78 U1.G2
PD9  (via drill 0.3)
  Top 0.203: J3.4 31.52,1.26 30.25,2.53 25.5,2.53 24,4.03 24,7.03 23.65,7.38 23.65,26.53 31.5,34.38 v31.5,36.03
  Bottom 0.203: v31.5,36.03 31.5,38.28 U$3.P21
PD10
  Bottom 0.203: U$3.P31 17.25,44.03 10.25,51.03 10.25,52.97 J2.2
PD11
  Bottom 0.203: J2.3 12.73,49.3 17.5,44.53 27.5,44.53 27.75,44.78 28.8,44.78 U$3.P32
PD12
  Bottom 0.203: J2.4 15.27,47.51 17.75,45.03 27.25,45.03 27.75,45.53 28.75,45.53 U$3.P33
PD13
  Bottom 0.203: J2.5 17.81,45.72 18,45.53 27,45.53 27.5,46.03 28.75,46.03 U$3.P34
REXT
  Bottom 0.203: IC1.2 18.66,11.28 16.25,11.28 16,11.03 R3.2
RGBB1  (via drill 0.3)
  Top 0.203: v15,7.33 15,8.18 BLED1.2
  Bottom 0.203: IC1.22 20.79,9.07 20.25,8.53 16,8.53 v15,7.33
RGBB2  (via drill 0.3)
  Top 0.203: 27.75,8.43 BLED2.2 27.85,8.03 29.5,8.03 29.75,8.28 v29.75,9.78
  Bottom 0.203: IC1.19 22.88,9.91 23.25,10.28 29.25,10.28 v29.75,9.78
RGBB3  (via drill 0.3)
  Top 0.203: v40,9.78 40,8.38 BLED3.2
  Bottom 0.203: IC1.16 38.14,11.9 40,10.03 v40,9.78
RGBB4  (via drill 0.3)
  Top 0.203: BLED4.2 52.6,8.68 51.5,9.78 49,9.78 48.75,10.03 47.5,10.03 v47.25,9.78
  Bottom 0.203: IC1.13 39.11,13.42 43,9.53 47,9.53 v47.25,9.78
RGBB5  (via drill 0.3)
  Top 0.203: BLED5.2 21.1,48.28 21.25,48.28 | 21.25,48.28 23.5,48.28 25.5,46.28 31.75,46.28 34.5,49.03 43.25,49.03 44.25,50.03 46,50.03 46.85,49.18 BLED7.2 | v19.5,41.78 19.5,42.03 20,42.53 20,47.03 21.25,48.28 | v19.5,21.53 19.5,21.78 19.75,22.03 19.75,38.03 v19.25,38.53
  Bottom 0.203: IC1.10 21.25,14.41 21.25,17.28 20.25,18.28 19.75,18.28 19,19.03 19,21.03 v19.5,21.53 | 19.75,41.53 v19.5,41.78 20.5,40.78 20.5,39.03 20,38.53 v19.25,38.53
RGBB6  (via drill 0.3)
  Top 0.203: BLED6.2 20.15,6.13 v19.75,6.78 20.25,7.28 20.25,14.28 19.25,15.28 v19.25,16.78 | v46,4.28 46,5.63 BLED8.2
  Bottom 0.203: v19.75,6.78 19.75,7.03 20.5,7.78 23.75,7.78 24.25,8.28 39.75,8.28 44.75,3.28 45,3.28 v46,4.28 | IC1.7 19.75,14.78 19.25,15.28 v19.25,16.78
RGBG1  (via drill 0.3)
  Top 0.203: v13.8,7.38 13.8,7.78 BLED1.1
  Bottom 0.203: IC1.23 20.28,9.32 20,9.03 15.4,9.03 v13.8,7.38
RGBG2  (via drill 0.3)
  Top 0.203: v30.75,9.03 30.75,8.53 29.75,7.53 27,7.53 26.75,7.78 26.75,8.23 BLED2.1
  Bottom 0.203: IC1.20 21.81,9.23 22,9.03 22.75,9.03 23.5,9.78 28.5,9.78 29.25,9.03 v30.75,9.03
RGBG3  (via drill 0.3)
  Top 0.203: v39,9.43 39.25,9.03 39.25,8.33 BLED3.1
  Bottom 0.203: IC1.17 37.9,11.39 39.25,10.03 39.25,9.53 v39,9.43
RGBG4  (via drill 0.3)
  Top 0.203: BLED4.1 51.8,8.73 51.25,9.28 v48.5,9.28
  Bottom 0.203: IC1.14 38.87,12.91 42.75,9.03 48,9.03 48.25,9.28 v48.5,9.28
RGBG5  (via drill 0.3)
  Top 0.203: BLED7.1 46.05,49.23 45.75,49.53 44.5,49.53 43.5,48.53 34.75,48.53 32,45.78 25.25,45.78 23.25,47.78 21.5,47.78 20.5,46.78 20.5,41.53 19.75,40.78 19.25,40.78 18.5,41.53 18.5,42.03 v19.25,43.03 19.25,47.03 20.12,47.91 20.12,48.46 BLED5.1 | v20,20.53 20.25,20.78 20.25,39.03 v19.75,39.53
  Bottom 0.203: IC1.11 21.75,14.42 21.75,17.53 20.5,18.78 20,18.78 19.5,19.28 19.5,20.03 v20,20.53 | v19.75,39.53 19.75,40.28 18.62,41.41 18.62,42.41 v19.25,43.03
RGBG6  (via drill 0.3)
  Top 0.203: BLED6.1 20.95,6.98 v21,7.03 20.75,7.28 20.75,14.53 20,15.28 v20,15.78 | v46.75,3.53 46.75,5.58 BLED8.1
  Bottom 0.203: v21,7.03 23.75,7.03 24.55,7.83 39.45,7.83 44.5,2.78 46,2.78 v46.75,3.53 | IC1.8 20.26,15.52 v20,15.78
RGBR1  (via drill 0.3)
  Top 0.203: BLED1.3 12.45,8.63 v12.3,8.53
  Bottom 0.203: v12.3,8.53 13,8.53 14.5,10.03 17.96,10.03 IC1.1
RGBR2  (via drill 0.3)
  Top 0.203: BLED2.3 25.35,8.63 v24.9,9.03
  Bottom 0.203: v24.9,9.03 23.5,9.03 23,8.53 21.75,8.53 21.25,9.03 21.25,9.86 IC1.21
RGBR3  (via drill 0.3)
  Top 0.203: v37.55,9.43 38,8.93 BLED3.3
  Bottom 0.203: IC1.18 37.3,10.88 37.55,10.58 v37.55,9.43
RGBR4  (via drill 0.3)
  Top 0.203: BLED4.3 49.6,8.63 v49.5,8.53
  Bottom 0.203: IC1.15 38.63,12.4 42.5,8.53 v49.5,8.53
RGBR5  (via drill 0.3)
  Top 0.203: BLED5.3 19.25,48.68 19.25,47.78 18.75,47.28 18.75,43.53 18,42.78 18,41.28 19,40.28 20,40.28 20.62,40.91 | BLED7.3 44.6,48.88 43.75,48.03 35,48.03 32.25,45.28 25,45.28 23,47.28 21.75,47.28 21.25,46.78 v21.25,43.28 21,43.03 21,41.28 20.62,40.91 | v20.5,19.53 20.75,19.78 20.75,40.78 20.62,40.91
  Bottom 0.203: IC1.12 22.25,14.42 22.25,17.78 v20.5,19.53
RGBR6  (via drill 0.3)
  Top 0.203: BLED6.3 21.95,5.98 v22,6.33 21.75,6.28 21.75,7.53 21.25,8.03 21.25,15.78 20.5,16.53 v20.5,16.78 | v47.5,2.78 47.5,4.98 BLED8.3
  Bottom 0.203: v22,6.33 23.8,6.33 24.9,7.43 39.1,7.43 44.25,2.28 47,2.28 v47.5,2.78 | IC1.9 20.77,16.52 v20.5,16.78
SWCK  (via drill 0.3)
  Top 0.203: DBG.3 4,13.26 4,42.78 11.4,50.18 23.35,50.18 v25.75,47.78
  Bottom 0.203: U$3.P36 27.75,47.53 27.5,47.28 26.75,47.28 26.25,47.78 v25.75,47.78
SWIO  (via drill 0.3)
  Top 0.203: v27,48.28 24.65,50.63 11.1,50.63 3.5,43.03 3.5,13.58 3.2,13.28 1.52,13.28 DBG.2
  Bottom 0.203: U$3.P37 28.8,48.28 v27,48.28
USB_VBUS
  Bottom 0.406: U$4.VBUS 61.95,14.33 61.5,14.78 61.5,18.78 60.25,20.03 59.46,20.03 U3.4 61.59,20.13 63.5,22.03 63.5,25.03 63,25.53 59.25,25.53 57.5,27.28 55.25,27.28 54.75,26.78 54.75,25.83 C6.1 54.8,24.6 U3.8
VBAT  (via drill 0.3)
  Top 0.406: BLED8.4 45.15,5.93 45.25,6.03 | 45.25,6.03 45.75,6.53 48.5,6.53 49,6.03 49,3.03 49.75,2.28 50.55,2.28 U$2.MOTOR2 50.8,2.53 51.5,2.53 52,3.03 52,6.53 53.6,8.13 BLED4.4 55.6,8.63 v56.5,9.53 | 44.62,6.66 42.65,8.63 BLED3.4 41.1,8.13 40.5,7.53 33.75,7.53 30.7,10.58 | 44.62,6.66 45.25,6.03 | BLED7.4 47.85,49.63 v48.25,49.78 | v60.25,49.28 60.25,46.03 63.5,42.78 63.5,20.03 62.25,18.78 v58.25,18.78 | BLED5.4 21.85,48.93 21.1,49.68 11.65,49.68 4.5,42.53 4.5,12.03 7,9.53 9.25,9.53 | 9.25,9.53 16,9.53 16.25,9.28 16.25,8.78 BLED1.4 16.1,8.48 BLED6.4 18.85,5.73 17.25,5.73 | U$1.MOTOR2 17.25,5.73 | 30.7,10.58 29.3,10.58 28.5,9.78 28.5,8.73 BLED2.4 | 9.25,9.53 v15.75,16.03 | v27,14.28 30.7,10.58 | v44,6.03 44.62,6.66 | v17.25,4.53 17.25,5.73
  Bottom 0.406: 57.25,13.03 S1.2 57.25,18.78 | 57.25,13.03 S1.5 56.5,10.78 v56.5,9.53 | C7.2 57.05,13.23 57.25,13.03 | 57.25,18.78 56.5,19.53 55.25,19.53 54.66,20.13 U3.5 51.11,20.13 U2.3 | v48.25,49.78 49,49.28 v60.25,49.28 | v58.25,18.78 57.25,18.78 | v15.75,16.03 16.5,16.03 17.5,17.03 17.5,21.78 19,23.28 20.75,23.28 23.5,20.53 25,20.53 25.5,20.03 25.5,15.78 v27,14.28 | D2.C 45.25,7.28 v44,6.03 | D1.C 18.8,2.98 v17.25,4.53
VBAT_UNSW
  Bottom 0.406: BAT.1 59,4.03 60,5.03 60,6.93 59.25,7.68 S1.6 59.25,13.28 58.5,14.03 58.5,15.03 59.25,15.78 S1.1

### Text on the board
tNames: Nodeconf EU 2018 rev 0.2